# EAGLE design M784 (EAGLE 6.6.0)
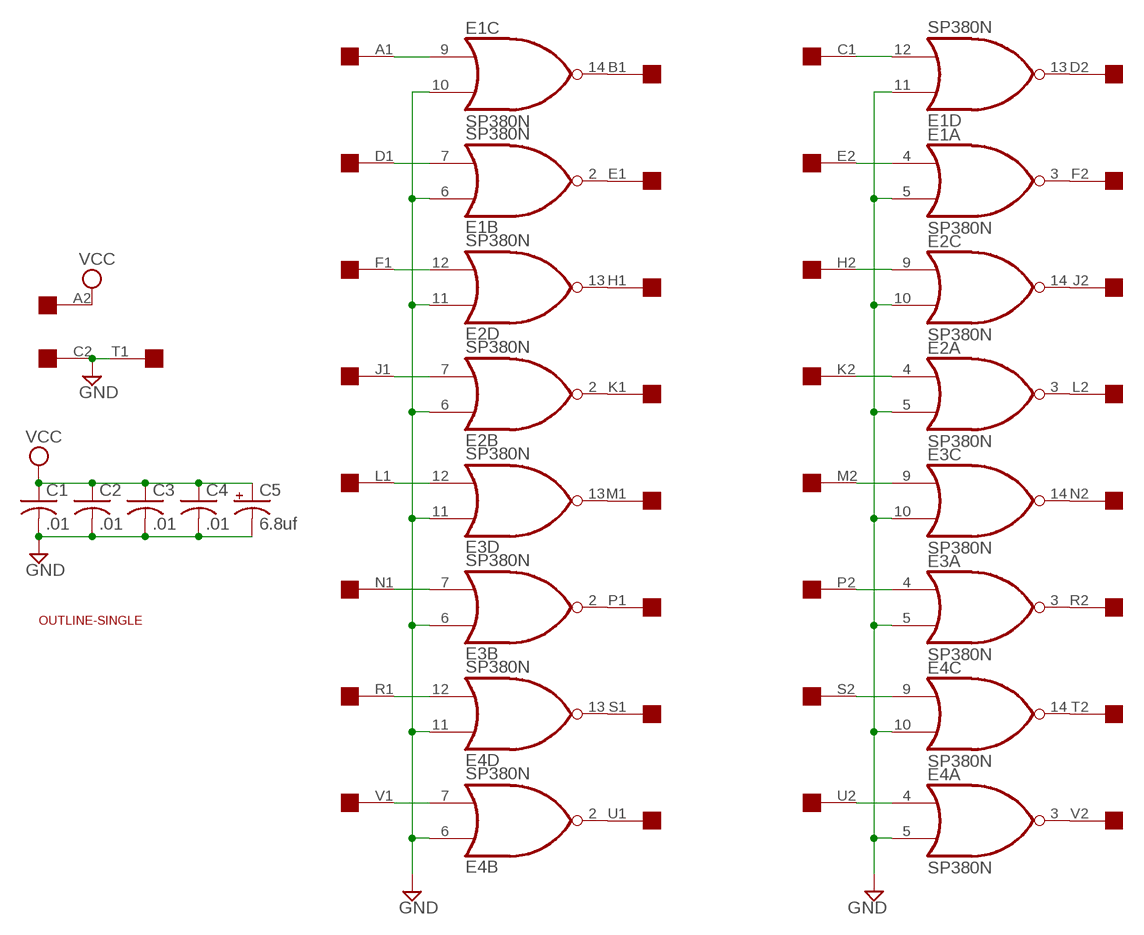
[diagram p0: schematic, sheet 1]

## Parts
C1  .01  C-US050-025X075  [C050-025X075]
C2  .01  C-US050-025X075  [C050-025X075]
C3  .01  C-US050-025X075  [C050-025X075]
C4  .01  C-US050-025X075  [C050-025X075]
C5  6.8uf  CPOL-USE15-5AXIAL  [E15-5]
E1  SP380N  [DIL14]
E2  SP380N  [DIL14]
E3  SP380N  [DIL14]
E4  SP380N  [DIL14]
U$1  SINGLE  [EDGE-CON2]
U$2  OUTLINE-SINGLE  [SINGLE]

## Nets
GND: C1.2 C2.2 C3.2 C4.2 C5.- E1.5(A:I1) E1.6(B:I0) E1.10(C:I1) E1.11(D:I0) E2.5(A:I1) E2.6(B:I0) E2.10(C:I1) E2.11(D:I0) E3.5(A:I1) E3.6(B:I0) E3.10(C:I1) E3.11(D:I0) E4.5(A:I1) E4.6(B:I0) E4.10(C:I1) E4.11(D:I0) U$1.C2 U$1.T1
N$1: E3.13(D:O) U$1.M1
N$2: E3.12(D:I1) U$1.L1
N$3: E1.4(A:I0) U$1.E2
N$4: E1.3(A:O) U$1.F2
N$5: E3.7(B:I1) U$1.N1
N$6: E2.13(D:O) U$1.H1
N$7: E2.4(A:I0) U$1.K2
N$8: E1.2(B:O) U$1.E1
N$9: E2.7(B:I1) U$1.J1
N$10: E4.2(B:O) U$1.U1
N$11: E2.2(B:O) U$1.K1
N$12: E4.7(B:I1) U$1.V1
N$13: E3.2(B:O) U$1.P1
N$14: E1.13(D:O) U$1.D2
N$15: E4.12(D:I1) U$1.R1
N$16: E4.13(D:O) U$1.S1
N$17: E1.12(D:I1) U$1.C1
N$18: E2.3(A:O) U$1.L2
N$19: E2.14(C:O) U$1.J2
N$20: E2.9(C:I0) U$1.H2
N$21: E3.14(C:O) U$1.N2
N$22: E3.3(A:O) U$1.R2
N$23: E4.14(C:O) U$1.T2
N$24: E4.3(A:O) U$1.V2
N$25: E1.14(C:O) U$1.B1
N$26: E3.9(C:I0) U$1.M2
N$27: E3.4(A:I0) U$1.P2
N$28: E2.12(D:I1) U$1.F1
N$29: E4.9(C:I0) U$1.S2
N$30: E1.7(B:I1) U$1.D1
N$31: E4.4(A:I0) U$1.U2
N$32: E1.9(C:I0) U$1.A1
VCC: C1.1 C2.1 C3.1 C4.1 C5.+ U$1.A2
Unconnected: U$1.B2

## Power pins joined to a net without a drawn wire
GND: E1.1(P:GND) E2.1(P:GND) E3.1(P:GND) E4.1(P:GND)
VCC: E1.8(P:VCC) E2.8(P:VCC) E3.8(P:VCC) E4.8(P:VCC)

## Library data of the parts
C1-C4 = rcl:C-US: CAPACITOR, American symbol
C5 = rcl:CPOL-US: POLARIZED CAPACITOR, American symbol
E1-E4 = dec-con:SP380: Quad NOR gate (use 8640)
U$1 = dec-con:SINGLE: Single-Height DEC board
U$2 = dec-con:OUTLINE-*: Board outlines for DEC boards.

## Board
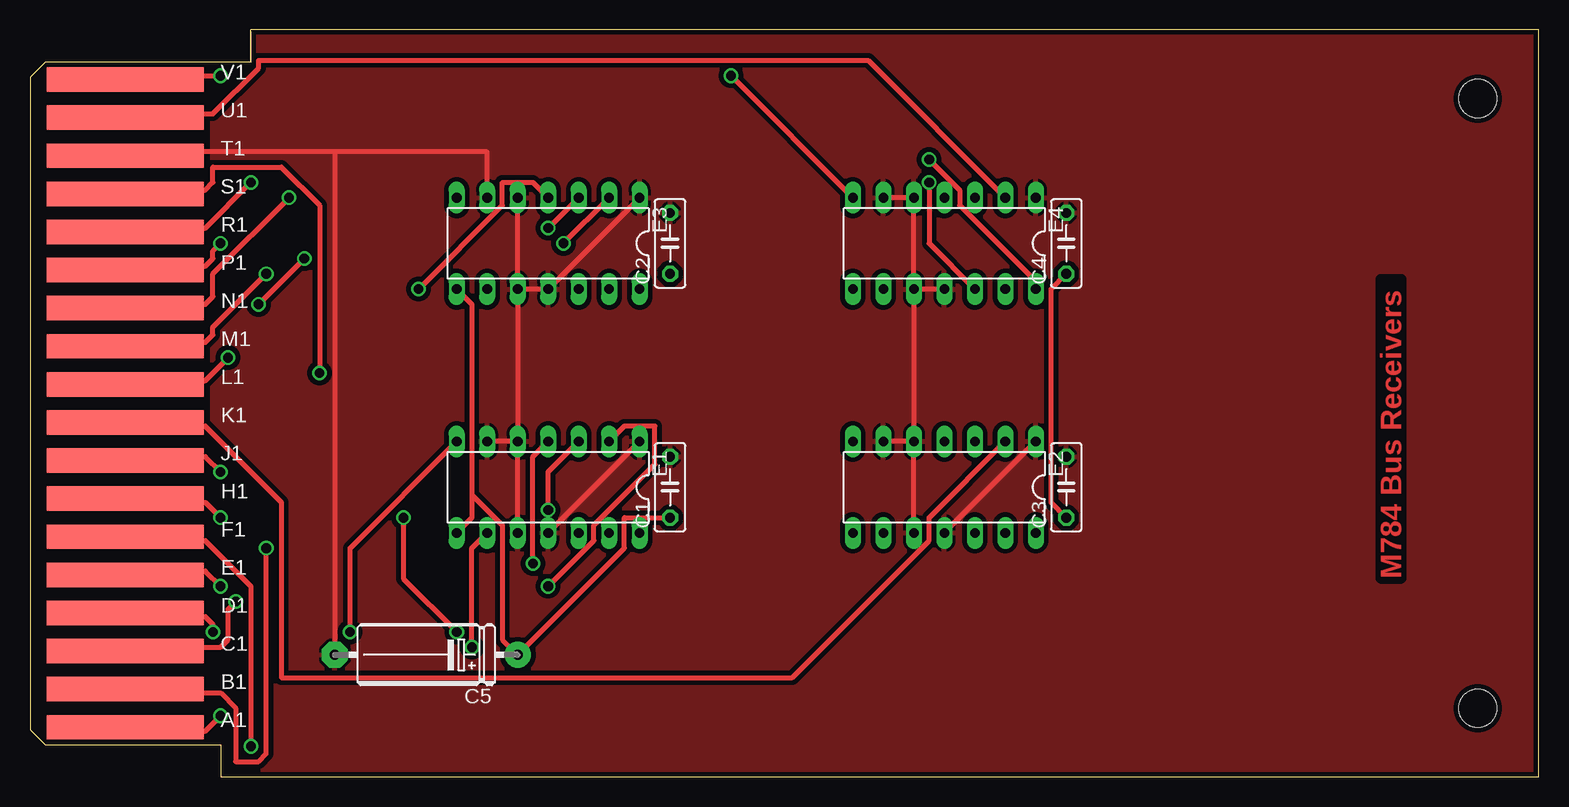
[diagram p1: board, top side]
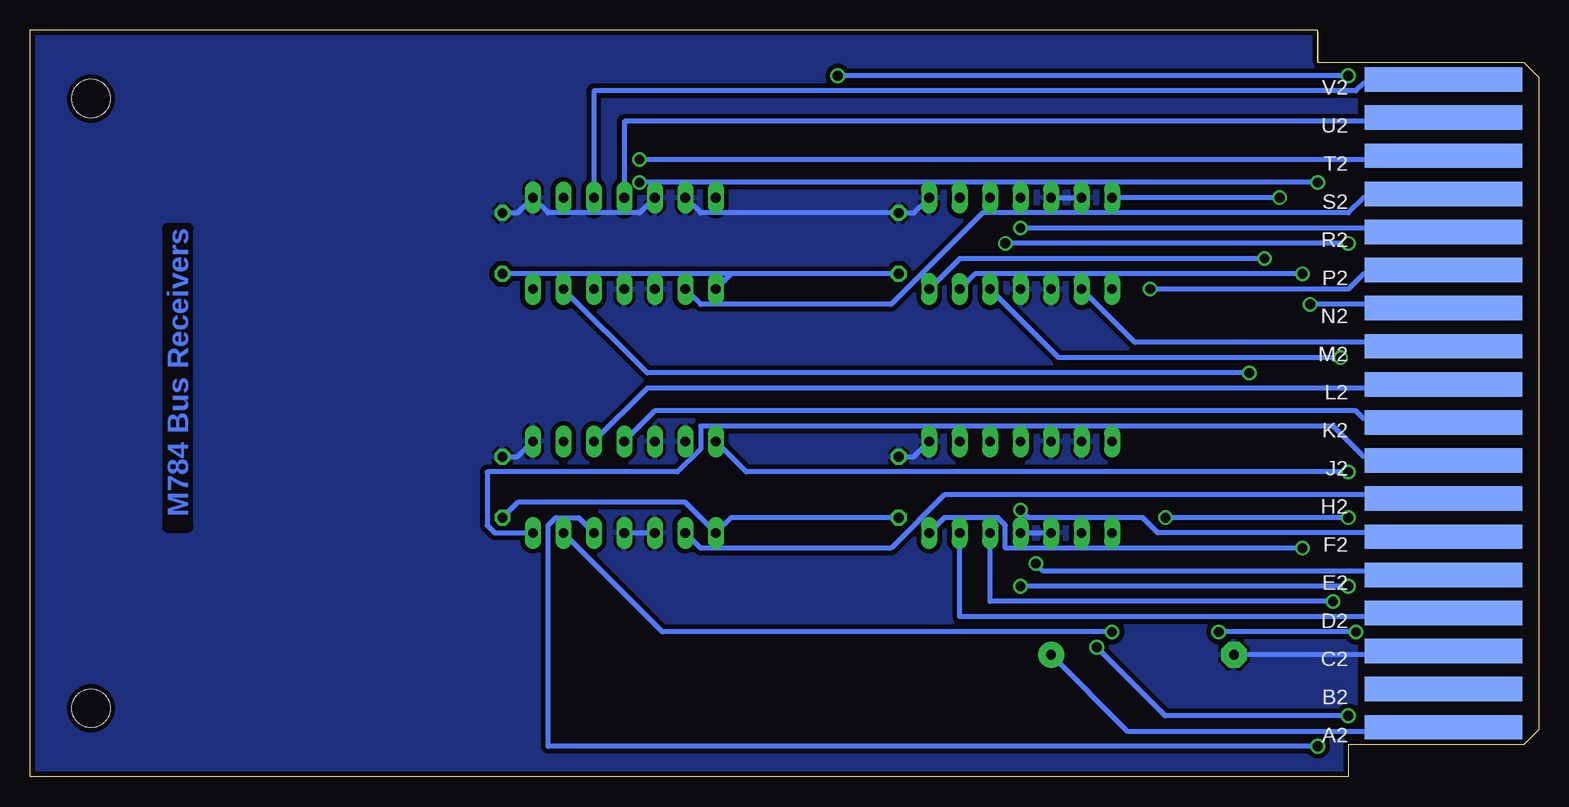
[diagram p2: board, bottom side, seen from below]

Size 125.73 x 62.23 mm. Coordinates in mm from the lower left corner, seen from the top.
Copper layers (1+16): Top 0.035mm / dielectric 1.5mm / Bottom 0.035mm
Design rules "16mils": minimum track width 16mil, minimum drill 32mil, track to track 15mil, track to pad 10mil, pad to pad 10mil, via to via 10mil, smd to smd 10mil, copper to edge 13mil, drill to drill 10mil, minimum pad ring 10mil, minimum via ring 8mil, stop-mask expansion 0mil, vias tented up to drill 0mil, thermal gap 10mil

### Footprints (pad centres in the part's own frame; a part is rotated, then mirrored left to right if it is on the bottom)
C050-025X075 = drill 0.813 octagon: 1 -2.54,0; 2 2.54,0
E15-5 = drill 0.813 pad 2.159: + -7.62,0 | drill 0.813 pad 2.159 octagon: - 7.62,0
DIL14 = drill 0.813 long: 1 -7.62,-3.81; 2 -5.08,-3.81; 3 -2.54,-3.81; 4 0,-3.81; 5 2.54,-3.81; 6 5.08,-3.81; 7 7.62,-3.81; 8 7.62,3.81; 9 5.08,3.81; 10 2.54,3.81; 11 0,3.81; 12 -2.54,3.81; 13 -5.08,3.81; 14 -7.62,3.81
EDGE-CON2 = smd 13.106 x 2.032: A1 7.938,4.128; B1 7.938,7.303; C1 7.938,10.477; D1 7.938,13.652; E1 7.938,16.828; F1 7.938,20.003; H1 7.938,23.177; J1 7.938,26.352; K1 7.938,29.527; L1 7.938,32.703; M1 7.938,35.877; N1 7.938,39.053; P1 7.938,42.227; R1 7.938,45.403; S1 7.938,48.578; T1 7.938,51.752; U1 7.938,54.928; V1 7.938,58.102 | smd 13.106 x 2.032 bottom: A2 7.938,4.128; B2 7.938,7.303; C2 7.938,10.477; D2 7.938,13.652; E2 7.938,16.828; F2 7.938,20.003; H2 7.938,23.177; J2 7.938,26.352; K2 7.938,29.527; L2 7.938,32.703; M2 7.938,35.877; N2 7.938,39.053; P2 7.938,42.227; R2 7.938,45.403; S2 7.938,48.578; T2 7.938,51.752; U2 7.938,54.928; V2 7.938,58.102
SINGLE = hole 3.175: 120.65,56.515; 120.65,5.715

### Placement (x,y rotation side)
C1  53.34,24.13 90 top
C2  53.34,44.45 90 top
C3  86.36,24.13 90 top
C4  86.36,44.45 90 top
C5  33.02,10.16 180 top
E1  43.18,24.13 180 top
E2  76.2,24.13 180 top
E3  43.18,44.45 180 top
E4  76.2,44.45 180 top
U$1  0,0 0 top
U$2  0,0 0 top

### Tracks (layer width: path | path; a pad name or v marks a point on that pad's centre or on a via)
GND
  Top 0.406: E2.5 E2.6 | E2.10 E2.5 | E2.11 E2.1 | E4.6 E4.5 E4.10 | E4.11 E4.10 | E4.10 E2.5 | E1.5 E1.6 | E1.10 E1.5 | E1.11 E1.1 | E3.10 E3.11 E3.1 | E3.10 E3.5 | E3.10 E1.5 | 25.4,52.07 38.1,52.07 E3.6 | 25.4,52.07 8.26,52.07 U$1.T1 | 25.4,52.07 C5.-
  Bottom 0.406: E2.1 85.09,26.67 C3.2 | E2.11 E2.10 | C4.2 85.09,46.99 E4.1 82.55,46.99 74.93,46.99 E4.5 | C5.- 8.26,10.16 U$1.C2 | E1.1 52.07,26.67 C1.2 | E1.11 E1.10 | E3.1 52.07,46.99 C2.2 69.85,46.99 E4.6 | E3.5 E3.6
  pour Top (isolate 0.406): 15.24,62.23 125.73,62.23 125.73,0 15.24,0
  pour Bottom (isolate 0.406): 15.24,62.23 125.73,62.23 125.73,0 15.24,0
N$1  (via drill 0.81)
  Top 0.406: v19.69,41.91 15.24,37.47 15.24,36.83 14.61,36.2 8.26,36.2 U$1.M1
  Bottom 0.406: E3.13 46.99,41.91 v19.69,41.91
N$2  (via drill 0.81)
  Top 0.406: v16.51,34.92 14.61,33.02 8.26,33.02 U$1.L1
  Bottom 0.406: E3.12 40.01,34.92 v16.51,34.92
N$3  (via drill 0.81)
  Top 0.406: E1.4 41.91,26.67 v41.91,17.78
  Bottom 0.406: v41.91,17.78 41.28,17.14 8.26,17.14 U$1.E2
N$4  (via drill 0.81)
  Top 0.406: E1.3 43.18,25.4 v43.18,22.23
  Bottom 0.406: v43.18,22.23 42.55,21.59 33.02,21.59 31.75,20.32 8.26,20.32 U$1.F2
N$5  (via drill 0.81)
  Top 0.406: v21.59,48.26 15.24,41.91 15.24,40.01 14.61,39.37 8.26,39.37 U$1.N1
  Bottom 0.406: v21.59,48.26 E3.7
N$6  (via drill 0.81)
  Top 0.406: v35.56,12.06 31.12,16.51 v31.12,21.59 | v15.88,21.59 14.61,22.86 8.26,22.86 U$1.H1
  Bottom 0.406: E2.13 73.03,12.06 v35.56,12.06 | v15.88,21.59 v31.12,21.59
N$7
  Bottom 0.406: E2.4 73.66,30.48 15.24,30.48 14.61,29.84 8.26,29.84 U$1.K2
N$8  (via drill 0.81)
  Top 0.406: E1.2 49.53,29.21 52.07,29.21 52.07,26.04 46.99,20.95 46.99,19.68 v43.18,15.88 | v15.88,15.88 14.61,17.14 8.26,17.14 U$1.E1
  Bottom 0.406: v15.88,15.88 v43.18,15.88
N$9  (via drill 0.81)
  Top 0.406: v15.88,25.4 14.61,26.67 8.26,26.67 U$1.J1
  Bottom 0.406: E2.7 66.04,25.4 v15.88,25.4
N$10
  Top 0.406: E4.2 69.85,59.69 19.05,59.69 19.05,59.05 15.24,55.24 8.26,55.24 U$1.U1
N$11
  Top 0.406: E2.2 74.93,21.59 74.93,19.68 63.5,8.26 20.96,8.26 20.96,22.86 14.61,29.21 8.26,29.21 U$1.K1
N$12  (via drill 0.81)
  Top 0.406: v58.42,58.42 E4.7 | v15.88,58.42 8.26,58.42 U$1.V1
  Bottom 0.406: v15.88,58.42 v58.42,58.42
N$13  (via drill 0.81)
  Top 0.406: v44.45,44.45 E3.2 | v15.88,44.45 15.24,43.81 15.24,43.18 14.61,42.55 8.26,42.55 U$1.P1
  Bottom 0.406: v15.88,44.45 v44.45,44.45
N$14
  Bottom 0.406: E1.13 48.26,13.34 8.26,13.34 U$1.D2
N$15  (via drill 0.81)
  Top 0.406: E4.12 74.93,44.45 v74.93,49.53 | v18.42,49.53 14.61,45.72 8.26,45.72 U$1.R1
  Bottom 0.406: v18.42,49.53 v74.93,49.53
N$16  (via drill 0.81)
  Top 0.406: v24.13,33.66 24.13,47.62 20.96,50.8 15.24,50.8 15.24,49.53 14.61,48.9 8.26,48.9 U$1.S1
  Bottom 0.406: E4.13 74.3,33.66 v24.13,33.66
N$17  (via drill 0.81)
  Top 0.406: v17.15,14.61 16.51,13.97 16.51,11.43 15.88,10.79 8.26,10.79 U$1.C1
  Bottom 0.406: E1.12 45.72,14.61 v17.15,14.61
N$18
  Bottom 0.406: E2.3 74.3,32.38 8.26,32.38 U$1.L2
N$19
  Bottom 0.406: E2.14 87,20.32 87.63,20.95 87.63,25.4 71.76,25.4 69.85,27.3 69.85,29.21 17.15,29.21 14.61,26.67 8.26,26.67 U$1.J2
N$20
  Bottom 0.406: E2.9 69.85,19.05 53.98,19.05 49.53,23.5 8.26,23.5 U$1.H2
N$21  (via drill 0.81)
  Top 0.406: v19.05,39.37 v22.86,43.18
  Bottom 0.406: E3.14 48.26,43.18 v22.86,43.18 | v19.05,39.37 8.26,39.37 U$1.N2
N$22  (via drill 0.81)
  Top 0.406: v43.18,45.72 E3.3
  Bottom 0.406: v43.18,45.72 8.26,45.72 U$1.R2
N$23  (via drill 0.81)
  Top 0.406: E4.14 83.82,41.27 77.47,47.62 77.47,48.9 v74.93,51.44
  Bottom 0.406: v74.93,51.44 8.26,51.44 U$1.T2
N$24
  Bottom 0.406: E4.3 78.74,57.15 15.24,57.15 14.61,57.78 8.26,57.78 U$1.V2
N$25  (via drill 0.81)
  Top 0.406: v19.69,19.05 19.69,1.91 19.05,1.27 17.15,1.27 17.15,5.71 15.88,6.99 8.26,6.99 U$1.B1
  Bottom 0.406: E1.14 49.53,21.59 45.09,21.59 44.45,20.95 44.45,19.05 v19.69,19.05
N$26
  Bottom 0.406: E3.9 33.66,36.2 8.26,36.2 U$1.M2
N$27  (via drill 0.81)
  Top 0.406: E3.4 41.91,49.53 39.37,49.53 39.37,47.62 v32.39,40.64
  Bottom 0.406: v32.39,40.64 15.88,40.64 14.61,41.91 8.26,41.91 U$1.P2
N$28  (via drill 0.81)
  Top 0.406: v18.42,2.54 18.42,15.88 14.61,19.68 8.26,19.68 U$1.F1
  Bottom 0.406: E2.12 80.01,21.59 81.92,21.59 82.55,20.95 82.55,2.54 v18.42,2.54
N$29
  Bottom 0.406: E4.9 69.85,39.37 53.98,39.37 46.36,46.99 15.88,46.99 14.61,48.26 8.26,48.26 U$1.S2
N$30  (via drill 0.81)
  Top 0.406: E1.7 26.67,19.05 v26.67,12.06 | v15.24,12.06 15.24,12.7 14.61,13.34 8.26,13.34 U$1.D1
  Bottom 0.406: v15.24,12.06 v26.67,12.06
N$31
  Bottom 0.406: E4.4 76.2,54.61 8.26,54.61 U$1.U2
N$32  (via drill 0.81)
  Top 0.406: E1.9 36.83,19.05 v36.83,10.79 | v15.88,5.08 14.61,3.81 8.26,3.81 U$1.A1
  Bottom 0.406: v36.83,10.79 31.12,5.08 v15.88,5.08
VCC
  Top 0.406: E1.8 36.83,21.59 36.83,23.5 | 36.83,23.5 36.83,39.37 E3.8 | 36.83,23.5 39.37,20.95 39.37,11.43 C5.+ 49.53,19.05 49.53,21.59 C1.1 | C4.1 85.09,40.64 85.09,22.86 C3.1
  Bottom 0.406: 67.31,41.91 E4.8 | C2.1 67.31,41.91 | 67.31,41.91 C4.1 | C1.1 67.31,21.59 E2.8 71.12,22.86 85.09,22.86 C3.1 | C5.+ 34.29,3.81 8.26,3.81 U$1.A2

### Text on the board
Top: M784 Bus Receivers
Bottom: M784 Bus Receivers